# EAGLE design analog_v10 (EAGLE 7.6.0)
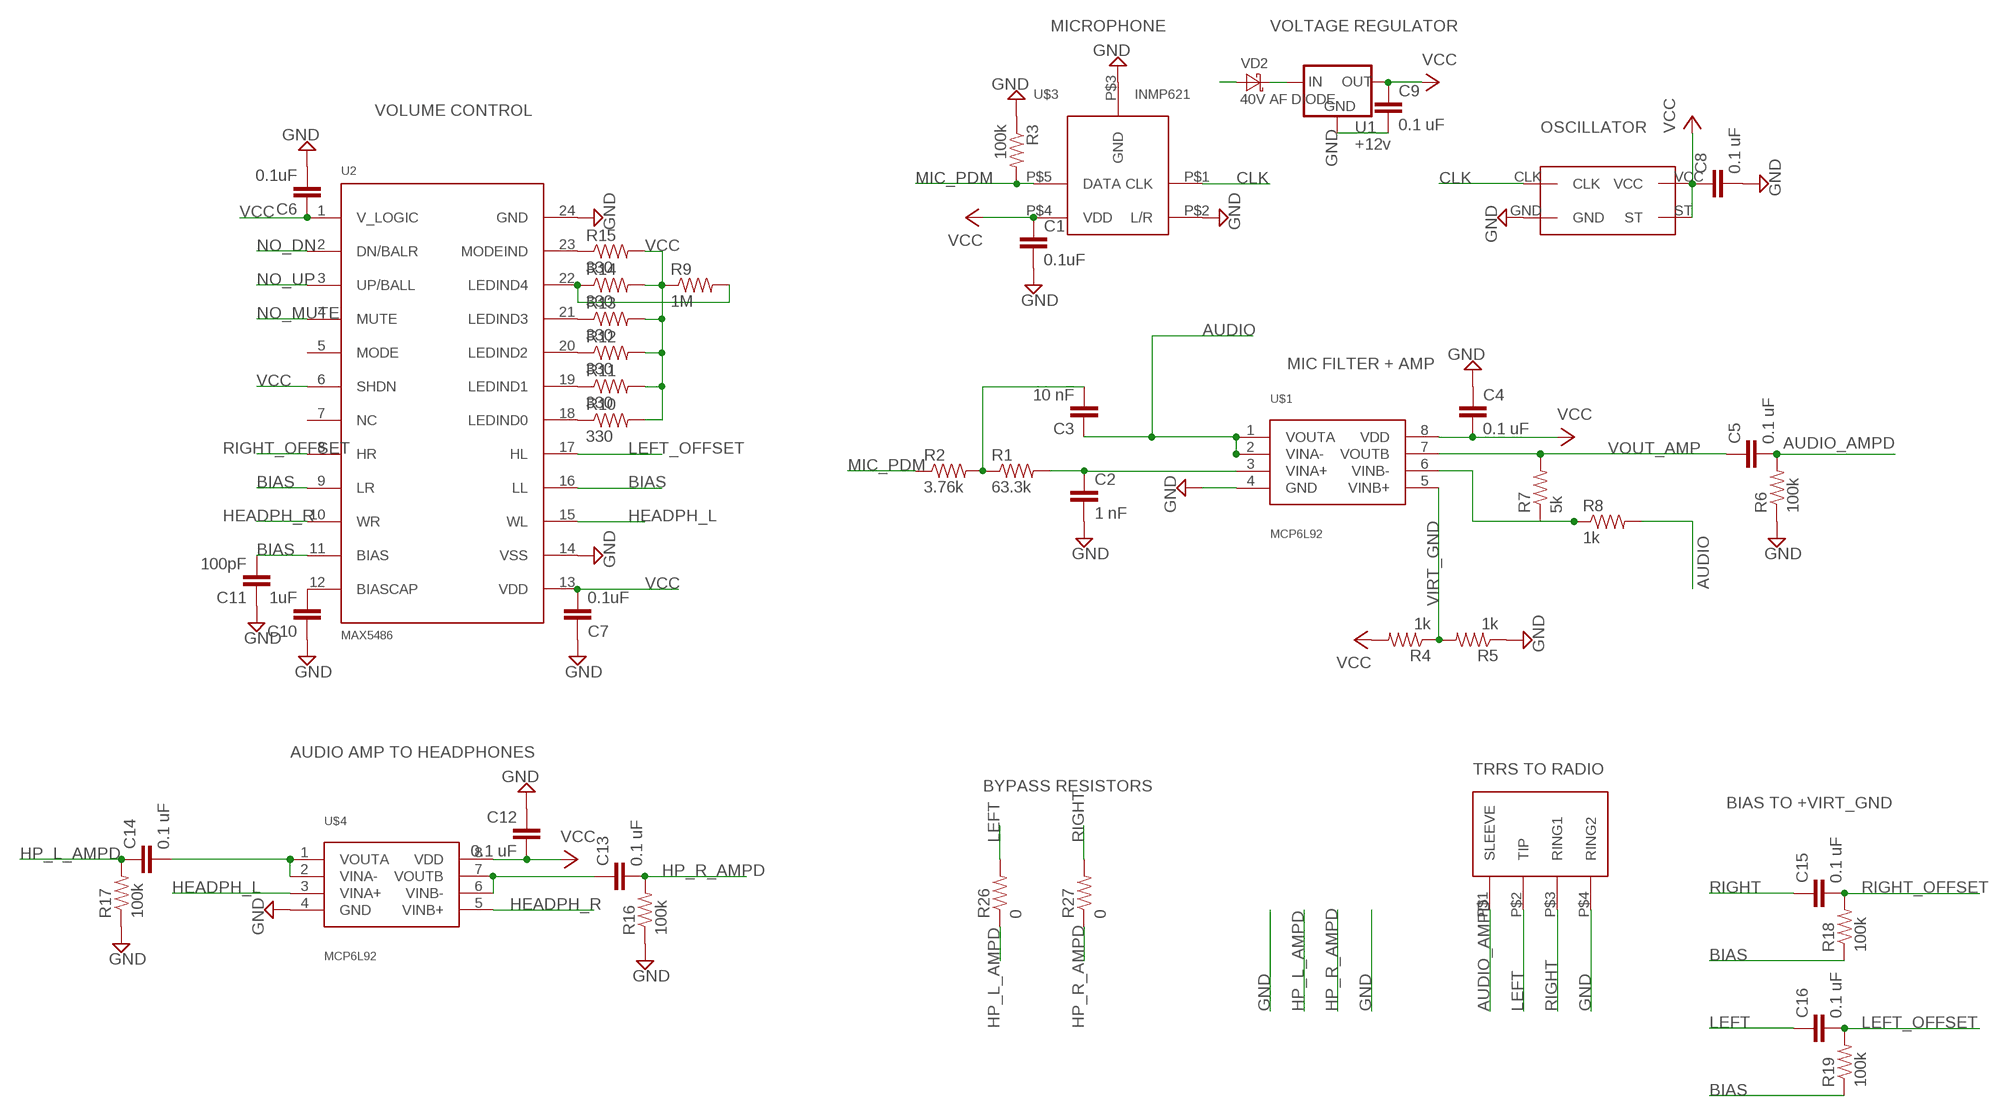
[diagram p0: schematic, sheet 1]

## Parts
C1  0.1uF  CAP0805  [0805]
C2  1 nF  CAP0805  [0805]
C3  10 nF  CAP0805  [0805]
C4  0.1 uF  CAP0805  [0805]
C5  0.1 uF  CAP0805  [0805]
C6  0.1uF  CAP0805  [0805]
C7  0.1uF  CAP0805  [0805]
C8  0.1 uF  CAP0805  [0805]
C9  0.1 uF  CAP0805  [0805]
C10  1uF  CAP0805  [0805]
C11  100pF  CAP0805  [0805]
C12  0.1 uF  CAP0805  [0805]
C13  0.1 uF  CAP0805  [0805]
C14  0.1 uF  CAP0805  [0805]
C15  0.1 uF  CAP0805  [0805]
C16  0.1 uF  CAP0805  [0805]
R1  63.3k  RESISTOR0805-RES  [0805]
R2  3.76k  RESISTOR0805-RES  [0805]
R3  100k  RESISTOR0805-RES  [0805]
R4  1k  RESISTOR0805-RES  [0805]
R5  1k  RESISTOR0805-RES  [0805]
R6  100k  RESISTOR0805-RES  [0805]
R7  5k  RESISTOR0805-RES  [0805]
R8  1k  RESISTOR0805-RES  [0805]
R9  1M  RESISTOR0805-RES  [0805]
R10  330  RESISTOR0805-RES  [0805]
R11  330  RESISTOR0805-RES  [0805]
R12  330  RESISTOR0805-RES  [0805]
R13  330  RESISTOR0805-RES  [0805]
R14  330  RESISTOR0805-RES  [0805]
R15  330  RESISTOR0805-RES  [0805]
R16  100k  RESISTOR0805-RES  [0805]
R17  100k  RESISTOR0805-RES  [0805]
R18  100k  RESISTOR0805-RES  [0805]
R19  100k  RESISTOR0805-RES  [0805]
R26  0  RESISTOR0805-RES  [0805]
R27  0  RESISTOR0805-RES  [0805]
RADIO  SJ-43514-SMT  [35MM_SMD_4WIRE]
U1  +12v  V_REG_78XX7812  [TO-252]
U2  MAX5486  [TSSOP24]
U$1  MCP6L92  [MSOP8]
U$2  SG-210STF  [SG-210STF]
U$3  INMP621  [CUSTOM_MIC]
U$4  MCP6L92  [MSOP8]
VD2  40V AF DIODE  DIODE-SCHOTTKY-SOD123  [SOD123]

## Nets
AUDIO: C3.1 R8.2 U$1.1(VOUTA) U$1.2(VINA-)
AUDIO_AMPD: C5.2 R6.2 RADIO.P$1(SLEEVE)
BIAS: C11.2 R18.1 R19.1 U2.9(LR) U2.11(BIAS) U2.16(LL)
CLK: U$2.CLK U$3.P$1(CLK)
GND: C1.2 C2.2 C4.1 C6.2 C7.1 C8.2 C9.2 C10.1 C11.1 C12.1 R3.1 R5.1 R6.1 R16.1 R17.1 RADIO.P$4(RING2) U1.3(GND) U2.14(VSS) U2.24(GND) U$1.4(GND) U$2.GND U$3.P$2(L/R) U$3.P$3(GND) U$4.4(GND)
HEADPH_L: U2.15(WL) U$4.3(VINA+)
HEADPH_R: U2.10(WR) U$4.5(VINB+)
HP_L_AMPD: C14.1 R17.2 R26.1
HP_R_AMPD: C13.2 R16.2 R27.1
LEFT: C16.1 R26.2 RADIO.P$2(TIP)
LEFT_OFFSET: C16.2 R19.2 U2.17(HL)
MIC_PDM: R2.1 R3.2 U$3.P$5(DATA)
N$2: C2.1 R1.2 U$1.3(VINA+)
N$3: C3.2 R1.1 R2.2
N$5: R10.1 U2.18(LEDIND0)
N$6: R11.1 U2.19(LEDIND1)
N$7: R7.1 R8.1 U$1.6(VINB-)
N$8: R12.1 U2.20(LEDIND2)
N$9: R13.1 U2.21(LEDIND3)
N$10: C13.1 U$4.6(VINB-) U$4.7(VOUTB)
N$11: R15.1 U2.23(MODEIND)
N$12: C10.2 U2.12(BIASCAP)
N$13: R9.2 R14.1 U2.22(LEDIND4)
N$14: C14.2 U$4.1(VOUTA) U$4.2(VINA-)
NO_DN: U2.2(DN/BALR)
NO_MUTE: U2.4(MUTE)
NO_UP: U2.3(UP/BALL)
RIGHT: C15.1 R27.2 RADIO.P$3(RING1)
RIGHT_OFFSET: C15.2 R18.2 U2.8(HR)
VBAT: VD2.A
VBATSAFE: U1.2(IN) VD2.C
VCC: C1.1 C4.2 C6.1 C7.2 C8.1 C9.1 C12.2 R4.2 R9.1 R10.2 R11.2 R12.2 R13.2 R14.2 R15.2 U1.1(OUT) U2.1(V_LOGIC) U2.6(SHDN) U2.13(VDD) U$1.8(VDD) U$2.ST U$2.VCC U$3.P$4(VDD) U$4.8(VDD)
VIRT_GND: R4.1 R5.2 U$1.5(VINB+)
VOUT_AMP: C5.1 R7.2 U$1.7(VOUTB)
Unconnected: U2.5(MODE) U2.7(NC)

## Notes on the sheet
- MICROPHONE | VOLTAGE REGULATOR
- VOLUME CONTROL
- OSCILLATOR
- MIC FILTER + AMP
- AUDIO AMP TO HEADPHONES
- TRRS TO RADIO
- BYPASS RESISTORS
- BIAS TO +VIRT_GND

## Library data of the parts
C1-C16 = SparkFun-Passives:CAP: Capacitor Standard 0603 ceramic capacitor, and 0.1" leaded capacitor.
R1-R5 R9-R15 R26 R27 = SparkFun-Passives:RESISTOR: Resistor Basic schematic elements and footprints for 0603, 1206, and PTH resistors.
R6-R8 R16-R19 = SparkFun-Resistors:RESISTOR: Resistor Basic schematic elements and footprints for 0603, 1206, and PTH resistors.
RADIO = 35mm_audio:SJ-43514-SMT
U1 = LP38691:V_REG_78XX: Voltage Regulator Standard 78xx regulator. IGO (Input Ground Output). Spark Fun Electronics SKU : COM-00107; PROD_ID: VREG-12370
U2 = MAX5486:MAX5486: Maxim's MAX3387E 3V, ±15kV ESD-Protected, AutoShutdown Plus RS-232 Transceiver for PDAs and Cell Phones General Description: The MAX3387E 3V powered EIA/TIA-232 and V.28/V.24 is a communications interface with low power requirements, high data-rate capabilities, and enhanced electrostatic discharge (ESD) protection. The MAX3387E has three receivers and three transmitters. All RS-232 inputs and outputs are protected to ±15kV using the IEC 1000-4-2 Air-Gap Discharge method, ±8kV using the IEC 1000-4-2 Contact Discharge method, and ±15kV using the Human Body Model. A proprietary low-dropout transmitter output stage enables true RS-232 performance from a +3.0V to +5.5V supply with a dual charge pump. The charge pump requires only four small 0.1µF capacitors for operation from a +3.3V supply. The MAX3387E is capable of running at data rates up to 250kbps while maintaining RS-232 compliant output levels. The MAX3387E has a unique VL pin that allows interoperation in mixed-logic voltage systems. Both input and output logic levels are pin programmable through the VL pin. The MAX3387E is available in a space-saving TSSOP package. Applications: Subnotebook/Palmtop Computers PDAs and PDA Cradles Cell Phone Data Cables Battery-Powered Equipment Hand-Held Equipment Peripherals Features: VL Pin for Compatibility with Mixed-Voltage Systems ±15kV ESD Protection on Rx Inputs and Tx Outputs Low 300µA Supply Current Guaranteed 250kbps Data Rate 1µA AutoShutdown Plus? with Receivers Active Meets EIA/TIA-232 Specifications Down to 3.0V Please send any comments to: messi@users.sourceforge.net
U$1 U$4 = Microchip_By_element14_Batch_1:MCP6L92: MCP6L91T-E/MS Dual op amp 10 MHz GBW 2.4V - 6.0V
U$2 = crystal-epson:SG-210STF
U$3 = InvenSense-INMP621ACEZ-R7:INMP621
VD2 = diode:DIODE-SCHOTTKY-: SCHOTTKY DIODE

## Net classes
0 default: clearance 0.205 mm

## Board
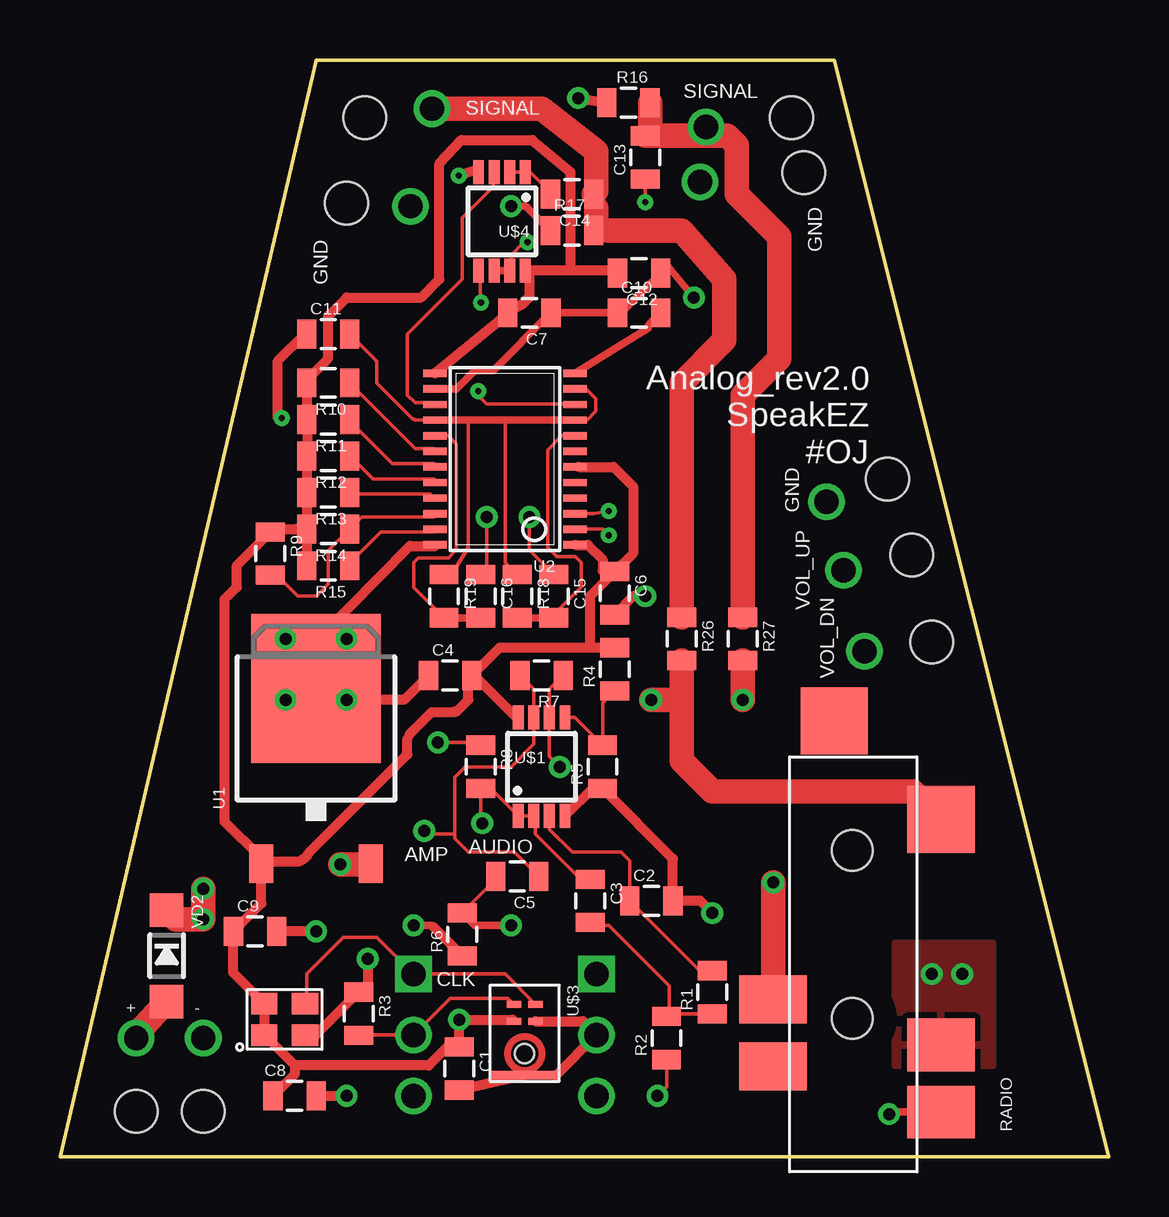
[diagram p1: board, top side]
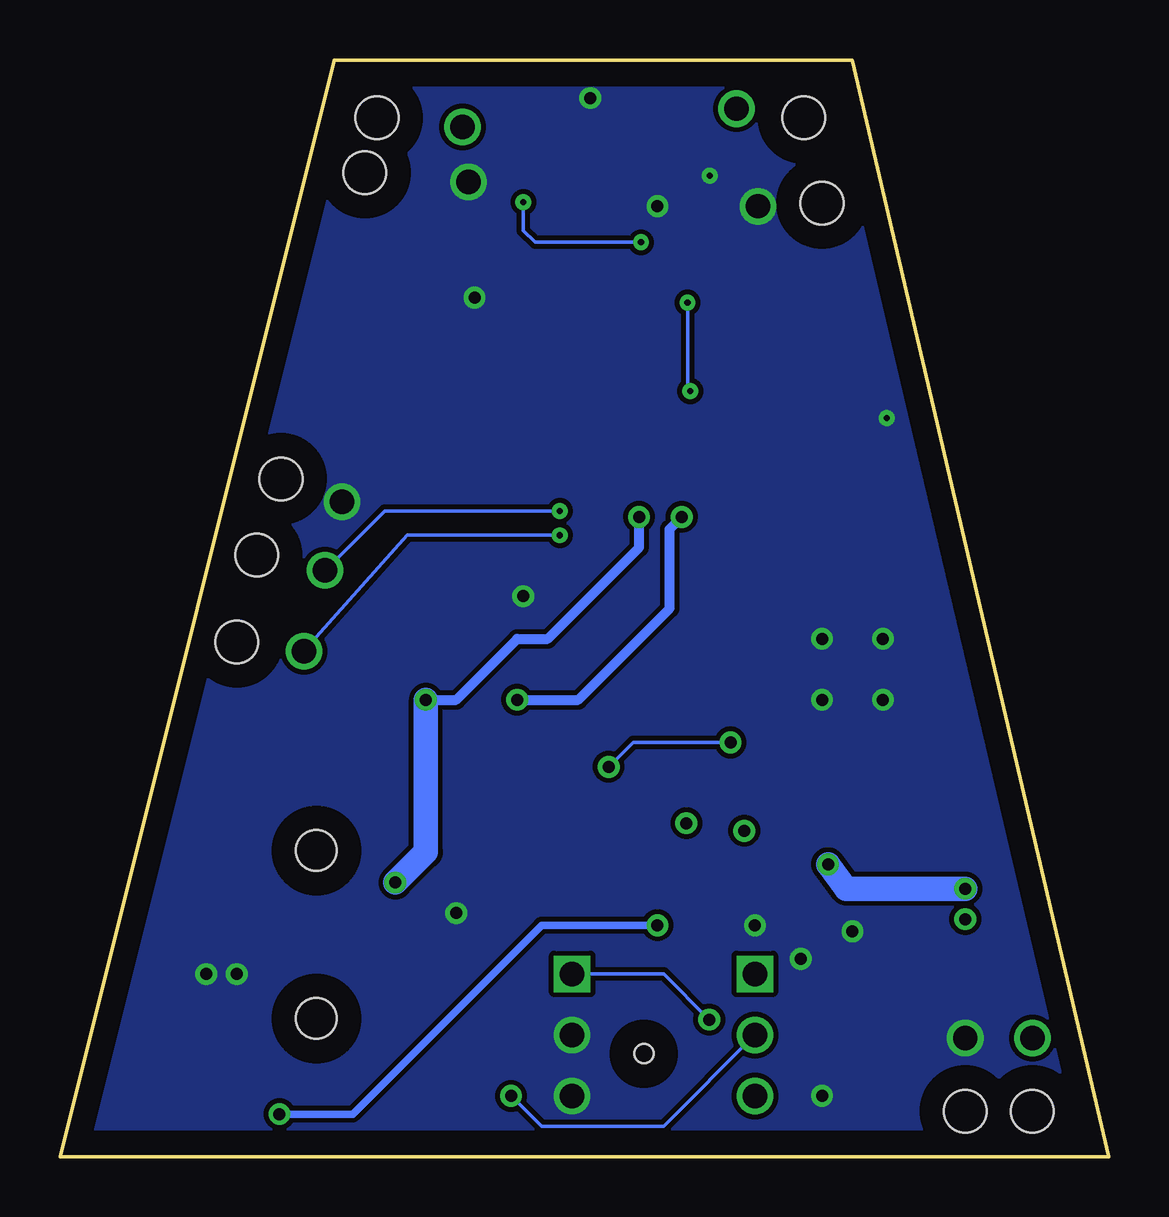
[diagram p2: board, bottom side, seen from below]

Size 43.69 x 45.72 mm. Coordinates in mm from the lower left corner, seen from the top.
Outline: 0,0 43.69,0 32.26,45.72 10.67,45.72 0,0
Copper layers (1*16): Top 0.035mm / dielectric 1.5mm / Bottom 0.035mm
Design rules "default *": minimum track width 6mil, minimum drill 10mil, track to track 6mil, track to pad 6mil, pad to pad 6mil, via to via 6mil, smd to smd 6mil, copper to edge 40mil, drill to drill 8mil, minimum pad ring 10mil, minimum via ring 8mil, stop-mask expansion 4mil, vias tented up to drill 0mil, thermal gap 10mil
Holes 1.78 mm at 3.17,1.9 5.97,1.9 34.48,28.26 35.5,25.08 36.32,21.46 30.48,43.31 30.99,41.02 12.7,43.31 11.94,39.75

### Footprints (pad centres in the part's own frame; a part is rotated, then mirrored left to right if it is on the bottom)
0805 = smd 0.8 x 1.2: 1 -0.9,0; 2 0.9,0
35MM_SMD_4WIRE = smd 2.2 x 2.8: P$1 0.6,-1.4; P$4 3.4,-1.4 | smd 2.8 x 2.8: P$2 12.8,-1.4; P$5 16.9,3.05 | smd 2 x 2.8: P$3 5.3,5.6; P$6 2.5,5.6 | hole 1.7: 4.5,2.3; 11.5,2.3
TO-252 = smd 1 x 1.6: 1 -2.28,-4.8; 2 2.28,-4.8 | smd 5.4 x 6.2: 3 0,2.5
TSSOP24 = smd 0.305 x 0.991: 1 -3.575,-2.918; 2 -2.925,-2.918; 3 -2.275,-2.918; 4 -1.625,-2.918; 5 -0.975,-2.918; 6 -0.325,-2.918; 7 0.325,-2.918; 8 0.975,-2.918; 9 1.625,-2.918; 10 2.275,-2.918; 11 2.925,-2.918; 12 3.575,-2.918; 13 3.575,2.918; 14 2.925,2.918; 15 2.275,2.918; 16 1.625,2.918; 17 0.975,2.918; 18 0.325,2.918; 19 -0.325,2.918; 20 -0.975,2.918; 21 -1.625,2.918; 22 -2.275,2.918; 23 -2.925,2.918; 24 -3.575,2.918
MSOP8 = smd 0.45 x 1: 1 -0.975,-2.05; 2 -0.325,-2.05; 3 0.325,-2.05; 4 0.975,-2.05; 5 0.975,2.05; 6 0.325,2.05; 7 -0.325,2.05; 8 -0.975,2.05
SG-210STF = smd 1.1 x 0.9: CLK 1.7,1.3; GND 1.7,0; ST 0,0; VCC 0,1.3
CUSTOM_MIC = smd 0.3 x 0.6: P$1 0,0; P$2 0.7,0; P$4 0.7,-0.9; P$5 0,-0.9 | smd 0.35 x 2.8: P$3 2.95,-0.45 | hole 0.8: 2.05,-0.45
SOD123 = smd 1.4 x 1.4: A 1.905,0; C -1.905,0

### Placement (x,y rotation side)
C1  16.64,3.68 270 top
C2  24.64,10.67 0 top
C3  22.1,10.67 270 top
C4  16.26,20.07 0 top
C5  19.05,11.68 180 top
C6  23.11,23.5 270 top
C7  19.56,35.18 180 top
C8  9.78,2.54 0 top
C9  8.13,9.4 0 top
C10  24.13,35.18 0 top
C11  11.18,34.29 0 top
C12  24.13,36.83 180 top
C13  24.38,41.66 90 top
C14  21.34,40.13 180 top
C15  20.57,23.37 270 top
C16  17.53,23.37 270 top
R1  27.18,6.86 90 top
R2  25.27,4.95 90 top
R3  12.45,5.97 270 top
R4  23.11,20.32 90 top
R5  22.61,16.26 90 top
R6  16.76,9.27 90 top
R7  20.07,20.07 180 top
R8  17.53,16.26 270 top
R9  8.76,25.15 270 top
R10  11.18,32.26 180 top
R11  11.18,30.73 180 top
R12  11.18,29.21 180 top
R13  11.18,27.69 180 top
R14  11.18,26.16 180 top
R15  11.18,24.64 180 top
R16  23.69,43.94 0 top
R17  21.34,38.61 0 top
R18  19.05,23.37 270 top
R19  16,23.37 270 top
R26  25.91,21.59 270 top
R27  28.45,21.59 270 top
RADIO  35.31,1.27 90 top
U1  10.67,17.02 0 top
U2  18.54,29.08 90 top
U$1  20.07,16.26 0 top
U$2  8.51,5.08 0 top
U$3  19.81,6.35 270 top
U$4  18.41,38.99 180 top
VD2  4.45,8.38 270 top

### Tracks (layer width: path | path; a pad name or v marks a point on that pad's centre or on a via)
AUDIO  (via drill 0.5)
  Top 0.152: C3.1 21.71,11.57 19.81,13.46 19.81,14.13 U$1.2 U$1.1 17.94,15.36 R8.2 17.53,13.97 v17.59,13.91
AUDIO_AMPD  (via drill 0.5)
  Top 0.152: C5.2 18.15,11.56 R6.2
  Top 0.305: v18.8,9.65 17.28,9.65 R6.2 | RADIO.P$1 34.64,1.87 v34.54,1.78
  Bottom 0.305: v18.8,9.65 23.62,9.65 31.5,1.78 v34.54,1.78
BIAS
  Top 0.152: R18.1 18.54,24.78 18.54,30.71 | 17.02,30.71 17.02,25.4 16.51,24.57 16.31,24.57 R19.1 | U2.11 21.61,31.97 21.97,31.97 22.33,31.61 22.33,31.07 21.97,30.72 21.61,30.72 U2.9 | U2.16 14.86,30.71 arc-45 14.68,30.78 13.21,32.26 13.21,33.05 arc45 13.13,33.23 C11.2
  Top 0.305: U2.16 17.02,30.71 18.54,30.71 U2.9
CLK  (via drill 1.02)
  Top 0.152: U$3.P$1 18.54,7.62 v14.73,7.62 13.21,9.14 11.81,9.14 10.29,7.62 10.29,6.46 U$2.CLK
GND  (via drill 0.25, 0.5, 1.02)
  Top 0.152: 19.34,3.42 U$3.P$3 20.67,3.4 | U$2.GND 10.66,5.08 | 12.83,7.25 R3.1 | R5.1 22.19,15.36 | v9.4,19.05 9.87,19.52 U1.3 v9.4,21.59 10.76,21.59 | 22.87,22.59 C6.2 | 17.34,41.16 U$4.4 | 15.65,25.46 U2.24 | v9.24,30.8 9.08,30.8 | 10.19,34.29 C11.1 | 16.01,32.01 U2.14 | 20.57,35.06 C7.1 | C10.1 23.38,35.18
  Top 0.305: C10.1 C7.1 18.04,32.77 17.27,32.77 16.51,32 U2.14 | v26.42,35.81 25.26,37.2 C12.1 23.38,35.18 | v18.8,39.62 19.31,39.62 arc-45 19.49,39.55 R17.1 | v14.73,9.65 15.38,9.65 arc-45 15.56,9.58
  Top 0.406: v10.67,9.4 C9.2 | C1.2 19.34,3.42 | U$3.P$2 21.78,5.65 v22.35,5.08 20.67,3.4 | 10.66,5.08 R3.1 | v12.83,8.26 12.83,7.25 | C8.2 v11.94,2.54 | R5.1 25.54,12.42 C2.2 26.67,10.67 v27.18,10.16 | 22.19,15.36 U$1.4 | C4.1 14.34,19.05 v11.94,19.05 | v24.38,23.37 23.89,23.37 C6.2 | v16.62,40.9 17.34,41.16 | v21.59,44.13 R16.1 | 15.65,25.46 14.57,25.46 10.76,21.59 | 10.19,34.29 9.08,33.18 9.08,30.8 | 15.56,9.58 R6.1
  other vias: 5.97,4.95 36.32,7.62 37.59,7.62 22.35,2.54 31.94,27.3 26.67,40.64 14.61,39.62 11.94,21.59
  pour Top: 34.8,8.89 34.8,3.81 38.86,3.81 38.86,8.89
  pour Bottom: 0,0 43.69,0 32.26,45.72 10.67,45.72
HEADPH_L
  Top 0.152: U2.15 15.54,31.43 14.8,31.43 14.48,31.75 14.48,34.29 16.76,36.58 16.76,39.16 18.05,40.44 18.05,40.98 U$4.3
HEADPH_R  (via drill 0.25)
  Top 0.152: 21.43,31.43 U2.10 17.78,31.37 17.42,31.72 v17.42,31.92 | U$4.5 17.51,36.87 17.51,35.64 v17.54,35.61
  Bottom 0.152: 17.34,32 v17.42,31.92 17.54,32.03 v17.54,35.61
HP_L_AMPD  (via drill 1.02)
  Top 0.152: 22.34,39.55 22.34,40.08 C14.1 22.34,39.55 | 22.34,39.55 22.34,38.65 R17.2
  Top 0.406: 25.91,29.76 25.91,30.18
  Top 1.016: R26.1 25.91,29.76 25.91,32.26 27.69,34.04 27.69,36.58 25.91,38.61 22.86,38.61 22.34,38.62 22.34,39.55 | v15.49,43.69 20.07,43.69 22.35,41.91 22.35,40.25 C14.1
HP_R_AMPD  (via drill 1.02)
  Top 1.016: C13.2 26.55,42.56 v26.92,42.93 | C13.2 27.8,42.56 28.19,42.16 28.19,40.13 29.97,38.35 29.97,33.27 28.45,31.75 R27.1 | C13.2 24.59,42.76 R16.2
LEFT  (via drill 0.5)
  Top 0.152: C16.1 17.78,24.52 v17.78,26.67
  Top 1.016: R26.2 25.91,19.05 | 25.91,19.05 25.91,16.51 27.18,15.24 35.54,15.24 RADIO.P$2 | v24.64,19.05 25.91,19.05
  Bottom 0.406: v24.64,19.05 22.1,19.05 18.29,22.86 18.29,26.16 v17.78,26.67
LEFT_OFFSET
  Top 0.152: R19.2 14.73,23.74 14.73,24.77 14.92,24.96 16.19,24.96 16.51,25.34 16.51,29.72 16.17,30.06 U2.17
  Top 0.305: C16.2 R19.2
MIC_PDM  (via drill 0.5, 1.02)
  Top 0.152: R3.2 v14.73,5.08 16.26,6.6 18.66,6.6 U$3.P$5 | R2.1 25.27,2.92 v24.89,2.54
  Bottom 0.152: v14.73,5.08 18.54,1.27 23.62,1.27 v24.89,2.54
N$2
  Top 0.152: R1.2 26.65,7.76 C2.1 23.74,12.33 23.37,12.7 21.34,12.7 20.39,13.64 U$1.3
N$3
  Top 0.152: R1.1 25.38,5.96 | 25.38,5.96 R2.2 | 25.38,5.96 25.38,7.13 22.86,9.65 22.21,9.65 C3.2
N$4  (via drill 1.02)
  other vias: 14.73,2.54
N$5
  Top 0.152: U2.18 15.59,29.53 14.8,29.53 12.1,32.23 R10.1
N$6
  Top 0.152: U2.19 15.59,28.89 13.84,28.89 12.1,30.64 R11.1
N$7  (via drill 0.5)
  Top 0.152: v20.83,16.26 20.39,16.69 U$1.6 20.39,19.49 R7.1 | v15.75,17.27 17.41,17.27 R8.1
  Bottom 0.152: v15.75,17.27 19.81,17.27 v20.83,16.26
N$8
  Top 0.152: U2.20 15.59,28.26 13.05,28.26 12.1,29.21 R12.1
N$9
  Top 0.152: U2.21 15.59,27.46 15.43,27.62 12.1,27.62 R13.1
N$10  (via drill 0.25)
  Top 0.152: 18.76,37.05 U$4.7 | 18.74,37.27 U$4.7 | v19.48,38.12 19.32,38.12 18.8,37.59 18.8,36.99 U$4.7 | v24.38,39.79 C13.1
  Top 0.305: U$4.6 U$4.7
  Bottom 0.152: v19.48,38.12 23.89,38.12 24.38,38.61 24.38,39.54 v24.38,39.79
N$11
  Top 0.152: U2.23 15.59,26.04 13.37,26.04 12.1,24.77 R15.1
N$12
  Top 0.305: C10.2 24.58,34.73 arc45 24.51,34.55 U2.12
N$13
  Top 0.152: R9.2 9.03,24.25 9.91,23.37 10.67,23.37 11.18,23.88 11.18,25.26 R14.1 12.1,26.19 12.57,26.67 15.59,26.67 U2.22
N$14
  Top 0.152: U$4.2 U$4.1 19.48,41.16 20.37,40.26 C14.2
NO_DN  (via drill 0.25, 1.02)
  Top 0.152: U2.2 22.61,26.16 v22.86,25.91
  Bottom 0.152: v22.86,25.91 29.21,25.91 v33.53,21.08
NO_MUTE
  Top 0.152: U2.4 21.87,27.46
NO_UP  (via drill 0.25, 1.02)
  Top 0.152: U2.3 22.24,26.81 v22.86,26.92
  Bottom 0.152: v32.64,24.45 30.16,26.92 v22.86,26.92
RIGHT  (via drill 0.5)
  Top 0.152: C15.1 19.56,25.28 v19.56,26.67
  Top 1.016: RADIO.P$3 29.72,6.58 v29.72,11.43 | v28.45,19.05 R27.2
  Bottom 0.406: v19.56,26.67 19.56,25.4 23.37,21.59 24.64,21.59 27.18,19.05 v28.45,19.05
  Bottom 1.016: v29.72,11.43 28.45,12.7 v28.45,19.05
RIGHT_OFFSET
  Top 0.152: C15.2 20.57,22.61 21.72,23.75 21.72,24.77 21.46,25.02 20.7,25.02 20.32,25.4 20.32,29.46 20.91,30.06 U2.8
  Top 0.305: C15.2 R18.2
VBAT  (via drill 1.02)
  Top 1.016: v3.17,4.95 3.05,4.95 VD2.A
VBATSAFE  (via drill 0.5)
  Top 1.016: VD2.C 4.83,9.91 v5.97,9.91 v5.97,11.18 | v11.68,12.19 12.92,12.19 U1.2
  Bottom 1.016: v5.97,11.18 10.92,11.18 v11.68,12.19
VCC  (via drill 0.5, 1.02)
  Top 0.152: C1.1 16.14,4.58 | 18.85,5.71 U$3.P$4 | 10.28,26.67 R14.2 | 8.88,26.16 R9.1 | 18.67,35.16 C7.2 18.76,35.26 | C6.1 22.57,24.39 22.61,24.43 | R4.2 22.1,21.22 | 21.61,28.75 U2.6 | 18.93,18.39 U$1.8 | 17.32,20 C4.2 17.15,20 | 19.55,36.87 U$4.8 | 10.33,30.67 R11.2 | 10.33,29.24 R12.2 | R10.2 10.33,32.28 10.33,32.43 | 8.39,12.31 U1.1
  Top 0.305: C12.2 23.2,36.86 arc45 23.02,36.94 | 14.48,17.42 arc-45 14.55,17.6 | 17.02,19.82 arc-45 17.09,20 C4.2 | 8.31,12.51 arc-45 8.39,12.34 U1.1
  Top 0.406: 16.14,4.58 15.37,3.81 9.78,3.81 | 9.78,3.81 U$2.ST U$2.VCC 7.23,7.66 C9.1 8.39,10.56 U1.1 | C1.1 v16.64,5.71 18.85,5.71 | R4.2 18.31,21.22 C4.2 | R10.2 R11.2 | R12.2 R13.2 10.28,26.67 arc-90 9.77,26.16 8.88,26.16 | R14.2 R15.2 | U2.13 18.67,35.16 | 22.1,21.22 22.1,23.38 C6.1 23.88,25.16 23.88,27.94 23.06,28.75 21.61,28.75 | 23.02,36.94 21.27,36.94 | 21.27,36.94 U$4.8 | 17.32,20 18.93,18.39 | 18.76,35.26 19.27,35.54 19.55,35.82 19.55,36.87 | 10.33,29.24 10.33,30.67 | 21.27,36.94 21.27,41.05 19.69,42.38 16.73,42.38 15.81,41.4 15.81,36.58 15.05,35.81 11.94,35.81 11.18,35.05 11.18,33.27 10.33,32.43 | 8.39,12.31 9.92,12.31 arc45 10.35,12.64 14.48,16.76 14.48,17.42 | 14.55,17.6 15.49,18.54 16.41,18.54 arc45 16.58,18.62 17.02,19.05 17.02,19.82 | 8.31,12.51 6.86,13.97 6.86,23.24 7.37,23.75 7.37,24.65 R9.1 | 9.78,3.81 9.78,3.44 C8.1 | U2.1 21.99,25.51 22.61,24.89 22.61,24.43
  Bottom 0.152: v22.35,7.62 18.54,7.62 v16.64,5.71
VIRT_GND
  Top 0.152: U$1.5 21.46,18.31 R5.2 22.61,18.91 R4.1
VOUT_AMP  (via drill 0.5)
  Top 0.152: R7.2 19.74,19.49 U$1.7 19.74,17.2 18.8,16.26 16.89,16.26 16.45,15.81 16.45,13.46 | 16.45,13.46 16.45,13.27 17.02,12.7 18.93,12.7 C5.1 | v15.18,13.59 15.3,13.46 16.45,13.46

### Text on the board
tPlace: Analog_rev2.0 / SpeakEZ / #OJ | + | -
tNames: SIGNAL | SIGNAL | GND | GND | GND | VOL_UP | VOL_DN | AMP | AUDIO | CLK